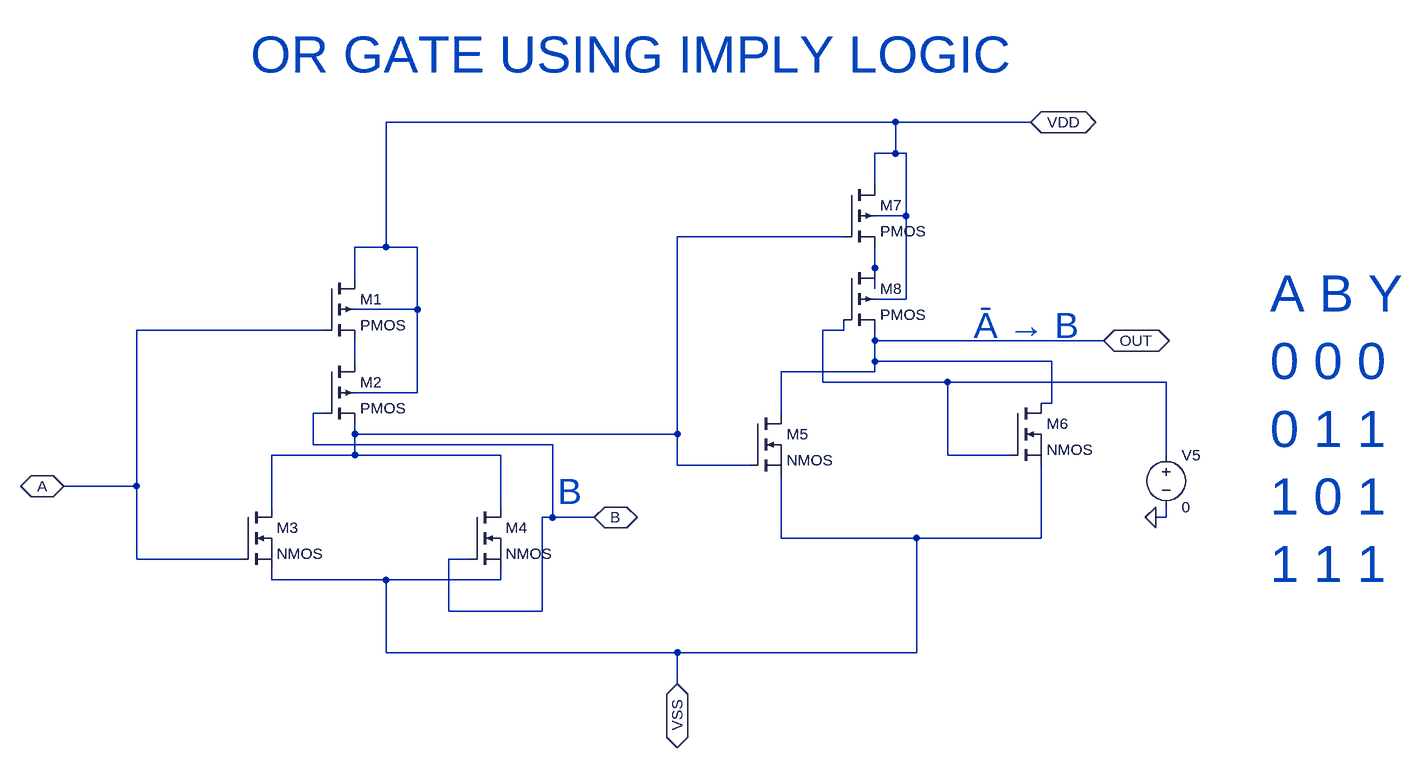
[diagram p0: schematic orgateimply.asc]
orgateimply.asc, the LTspice schematic file:
Version 4
SHEET 1 1120 700
WIRE 336 -272 -448 -272
WIRE 544 -272 336 -272
WIRE 336 -224 336 -272
WIRE 336 -224 304 -224
WIRE 352 -224 336 -224
WIRE 304 -176 304 -224
WIRE 352 -128 352 -224
WIRE 352 -128 304 -128
WIRE 256 -96 0 -96
WIRE -448 -80 -448 -272
WIRE -448 -80 -496 -80
WIRE -400 -80 -448 -80
WIRE 304 -48 304 -80
WIRE -496 -32 -496 -80
WIRE 304 -16 304 -48
WIRE 352 0 352 -128
WIRE 352 0 304 0
WIRE -400 16 -400 -80
WIRE -400 16 -496 16
WIRE -544 48 -832 48
WIRE 256 48 256 32
WIRE 256 48 224 48
WIRE 304 64 304 48
WIRE 656 64 304 64
WIRE -496 96 -496 64
WIRE 304 96 304 64
WIRE 576 96 304 96
WIRE 304 112 304 96
WIRE 304 112 160 112
WIRE 224 128 224 48
WIRE 416 128 224 128
WIRE 752 128 416 128
WIRE -400 144 -400 16
WIRE -400 144 -496 144
WIRE 576 160 576 96
WIRE 576 160 560 160
WIRE -544 176 -560 176
WIRE 160 176 160 112
WIRE -496 208 -496 192
WIRE 0 208 0 -96
WIRE 0 208 -496 208
WIRE -560 224 -560 176
WIRE -192 224 -560 224
WIRE -496 240 -496 208
WIRE -496 240 -624 240
WIRE -272 240 -496 240
WIRE 416 240 416 128
WIRE 512 240 416 240
WIRE 752 240 752 128
WIRE 0 256 0 208
WIRE 112 256 0 256
WIRE -832 288 -832 48
WIRE -832 288 -944 288
WIRE -624 320 -624 240
WIRE -272 320 -272 240
WIRE -192 336 -192 224
WIRE -192 336 -208 336
WIRE -128 336 -192 336
WIRE 752 336 752 320
WIRE 752 336 736 336
WIRE 160 368 160 272
WIRE 368 368 160 368
WIRE 560 368 560 256
WIRE 560 368 368 368
WIRE -832 400 -832 288
WIRE -672 400 -832 400
WIRE -320 400 -352 400
WIRE -624 432 -624 416
WIRE -448 432 -624 432
WIRE -272 432 -272 416
WIRE -272 432 -448 432
WIRE -352 480 -352 400
WIRE -208 480 -208 336
WIRE -208 480 -352 480
WIRE -448 544 -448 432
WIRE 0 544 -448 544
WIRE 368 544 368 368
WIRE 368 544 0 544
WIRE 0 592 0 544
FLAG 736 336 0
FLAG 656 64 OUT
IOPIN 656 64 BiDir
FLAG -944 288 A
IOPIN -944 288 BiDir
FLAG -128 336 B
IOPIN -128 336 BiDir
FLAG 544 -272 VDD
IOPIN 544 -272 BiDir
FLAG 0 592 VSS
IOPIN 0 592 BiDir
SYMBOL pmos4 -544 -32 R0
SYMATTR InstName M1
SYMBOL pmos4 -544 96 R0
SYMATTR InstName M2
SYMBOL nmos -672 320 R0
SYMATTR InstName M3
SYMBOL nmos -320 320 R0
SYMATTR InstName M4
SYMBOL nmos 112 176 R0
SYMATTR InstName M5
SYMBOL nmos 512 160 R0
SYMATTR InstName M6
SYMBOL voltage 752 224 R0
WINDOW 123 0 0 Left 0
WINDOW 39 0 0 Left 0
SYMATTR InstName V5
SYMATTR Value 0
SYMBOL pmos4 256 -176 R0
SYMATTR InstName M7
SYMBOL pmos4 256 -48 R0
SYMATTR InstName M8
TEXT -184 296 Left 5 ;B
TEXT -656 -376 Left 6 ;OR GATE USING IMPLY LOGIC
TEXT 456 40 Left 5 ;Ā → B
TEXT 912 -8 Left 6 ;A B Y\n0 0 0\n0 1 1\n1 0 1\n1 1 1

The netlist it stands for:
* orgateimply.asc
M1 VDD A N004 VDD PMOS
M2 N004 B N001 VDD PMOS
M3 N001 A VSS VSS NMOS
M4 N001 B VSS VSS NMOS
M5 OUT N001 VSS VSS NMOS
M6 OUT N003 VSS VSS NMOS
V5 N003 0 0
M7 VDD N001 N002 VDD PMOS
M8 N002 N003 OUT VDD PMOS
.model NMOS NMOS
.model PMOS PMOS
.lib standard.mos
* B
* OR GATE USING IMPLY LOGIC
* Ā → B
* A B Y
* 0 0 0
* 0 1 1
* 1 0 1
* 1 1 1
.backanno
.end